# Altium schematic sheet Turbospeed.SchDoc
size A4; SheetNumber: 12; SheetTotal: 14; SPICEModelCacheAOEYIQHI: <root> / <DocumentId>AOEYIQHI</DocumentId> / <CacheFrame Number="0"> / <Model Name="0603_885012006042_470pf" Kind="CKT"> / <Text>******* / .subckt 0603_885012006042_470pF 1 2 / Rser 1 3 0.0647178553788 / Lser 2 4 3.67931779E-10 / C1 3 4 0.00000000047 / Rpar 3 4 10000000000 / .ends 0603_885012006042_470pF</Text> / </Model> / </CacheFrame> / </root>
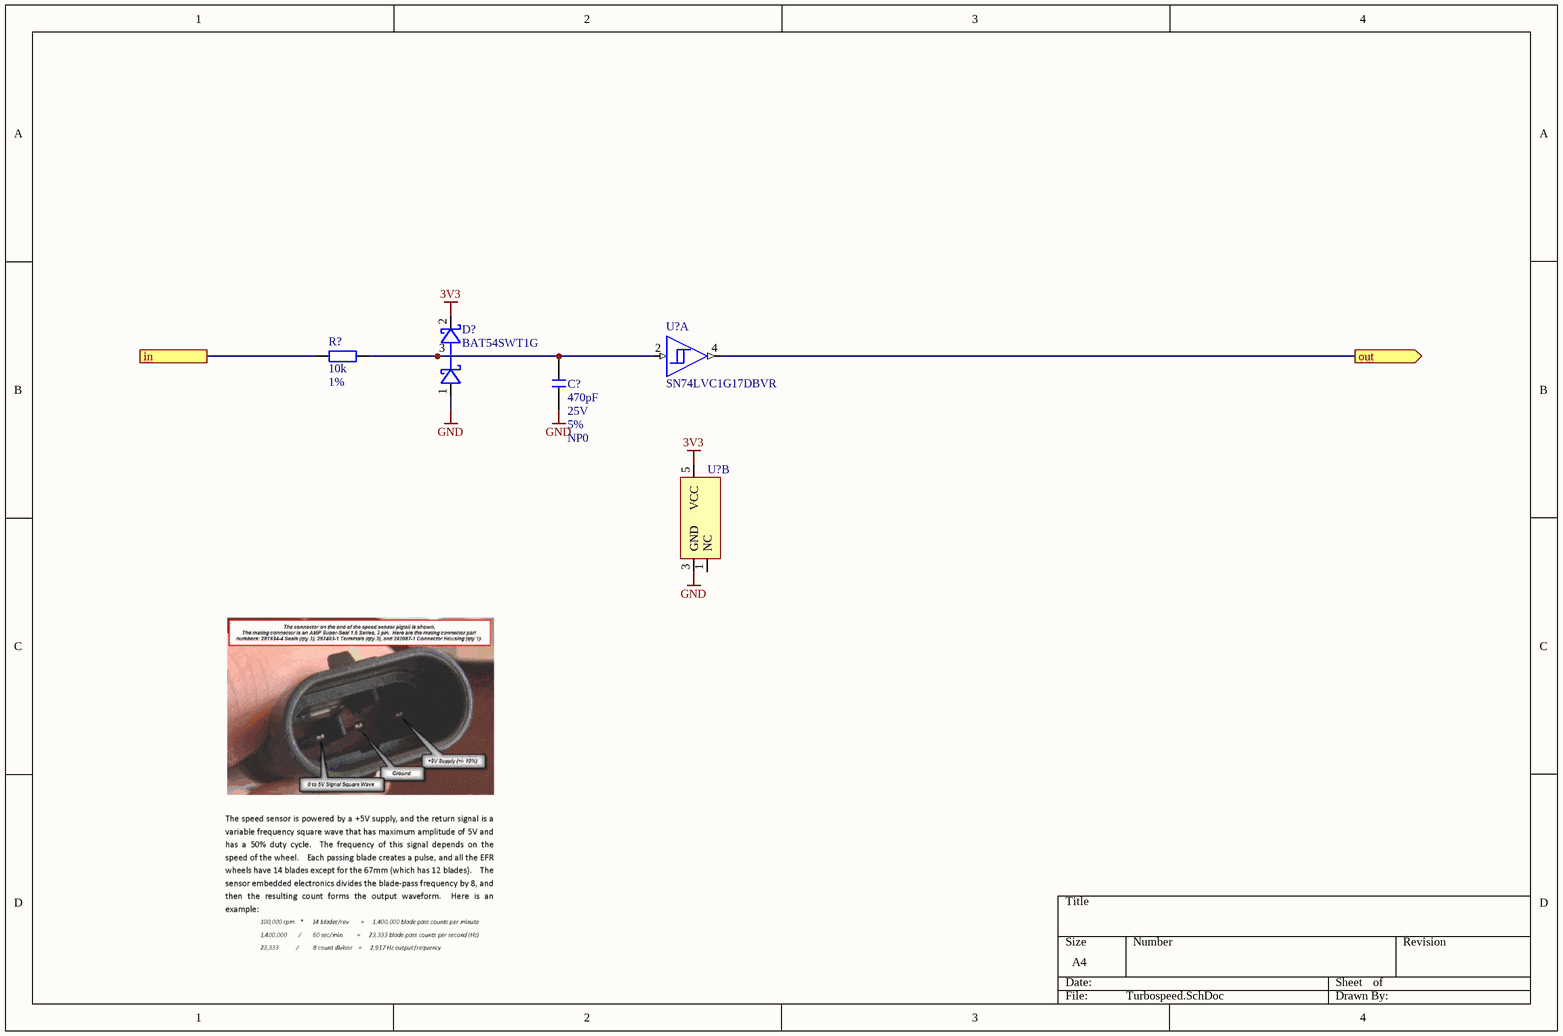
[diagram p0: Turbospeed.SchDoc]

## Parts
(Parts that share a designator on the sheet are numbered #1, #2 ... from top to bottom, then left to right.)
C?  value 470pF  Voltage Rating: 25V  Tolerance: 5%  Dielectric: NP0  [WCAP-CSGP_0603_L1.6W0.8H0.8_Reflow]  (hidden comment: 885012006042)
D?  BAT54SWT1G  [ONSC-SOT-323-3-Generic]
R?  value 10k  Tolerance: 1%  [SMD_0603_RES]  (hidden comment: ERJ-3EKF1002V)
U?#1  SN74LVC1G17DBVR  [TI-SOT23-5_DBV0005A]  (part A of 2)
U?#2  SN74LVC1G17DBVR  [TI-SOT23-5_DBV0005A]  (value not drawn)  (part B of 2)

## Ports
in (in), out (out)

## Nets
3V3: D?.2(K) U?#2.5(VCC)
GND: C?.1 D?.1(A) U?#2.3(GND)
out: U?#1.4(Y) ; port out
NetC?_2: C?.2 D?.3(K/A) R?.2 U?#1.2(A)

Not connected (* = marked no-connect by the designer): R? 1; U?#2 1(NC)

## Library data of the parts
C? = CMP-001-00242-9: WCAP-CSGP Multilayer Ceramic Chip Capacitor, General Purpose, size 0603, NP0, 470pF, 25VDC; Capacitance Tolerance: +/-5%; Insulation Resistance: 10GO; Q Factor: 1000; Operating Temperature (Max): 125°C; Operating Temperature (Min): -55°C; Capacitor Type: Ceramic; Pins: 2; Mounting Technology: SMT; Case/Package: 0603
D? = CMP-004-00031-7: Rectifier Diode, Schottky, 2 Element, 0.2A, 30V V(RRM), Silicon; Forward Current: 200mA; Forward Voltage: 220mV; Operating Temperature (Min): -55°C; Peak Reverse Voltage: 30V; Pins: 3; RoHS Compliant: Yes; Case/Package: SOT-323; Operating Temperature (Max): 125°C; Mounting Technology: SMD
R? = CMP-009-07799-A10: RES SMD 10K OHM 1% 1/10W 0603 ±100ppm/°C; Voltage Rating: 75V; Power: 100mW; Pins: 2; RoHS Compliant: Yes; Temperature Coefficient: ±100ppm/°C; Operating Temperature (Min): -55°C; Mounting Technology: SMT; Case/Package: 0603; Operating Temperature (Max): 125°C
U?#1 U?#2 = CMP-016-00026-A01: Single 1.65-V to 5.5-V buffer with Schmitt-Trigger inputs 5-SOT-23 -40 to 125; Supply Voltage (Max): 5.5V; Propagation Delay (Max): 5.5ns; Supply Voltage (Min): 1.8V; Logic Type: Buffer /w Schmitt Trigger; Operating Temperature (Max): 125°C; Pins: 5; Operating Temperature (Min): -55°C; Mounting Technology: Surface Mount; RoHS Compliant: Yes; Case/Package: SOT-23